# EAGLE design HDMI-DB26 (EAGLE 8.0.1)
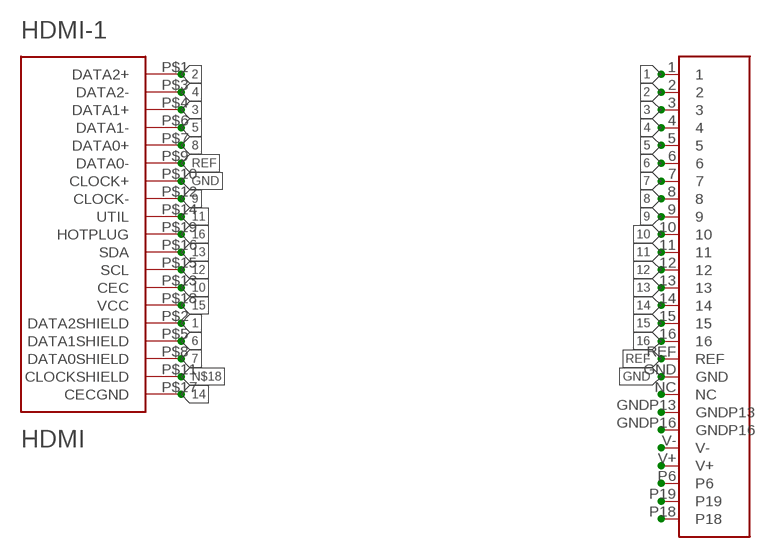
[diagram p0: schematic, sheet 1]

## Parts
DB26_1  DB26  [DB26-PLUG]
HDMI-1  HDMI  [HDMI_A]

## Nets
1: DB26_1.1 HDMI-1.P$2(DATA2SHIELD)
2: DB26_1.2 HDMI-1.P$1(DATA2+)
3: DB26_1.3 HDMI-1.P$4(DATA1+)
4: DB26_1.4 HDMI-1.P$3(DATA2-)
5: DB26_1.5 HDMI-1.P$6(DATA1-)
6: DB26_1.6 HDMI-1.P$5(DATA1SHIELD)
7: DB26_1.7 HDMI-1.P$8(DATA0SHIELD)
8: DB26_1.8 HDMI-1.P$7(DATA0+)
9: DB26_1.9 HDMI-1.P$12(CLOCK-)
10: DB26_1.10 HDMI-1.P$13(CEC)
11: DB26_1.11 HDMI-1.P$14(UTIL)
12: DB26_1.12 HDMI-1.P$15(SCL)
13: DB26_1.13 HDMI-1.P$16(SDA)
14: DB26_1.14 HDMI-1.P$17(CECGND)
15: DB26_1.15 HDMI-1.P$18(VCC)
16: DB26_1.16 HDMI-1.P$19(HOTPLUG)
GND: DB26_1.GND HDMI-1.P$10(CLOCK+)
N$18: HDMI-1.P$11(CLOCKSHIELD)
N$38: DB26_1.NC
N$39: DB26_1.GNDP13
N$40: DB26_1.GNDP16
N$41: DB26_1.V-
N$42: DB26_1.V+
N$43: DB26_1.P6
N$44: DB26_1.P19
N$45: DB26_1.P18
REF: DB26_1.REF HDMI-1.P$9(DATA0-)

## Library data of the parts
DB26_1 = HDMI-DB26:DB26
HDMI-1 = HDMI-DB26:HDMI: Horizonal HDMI type "A" jack

## Board
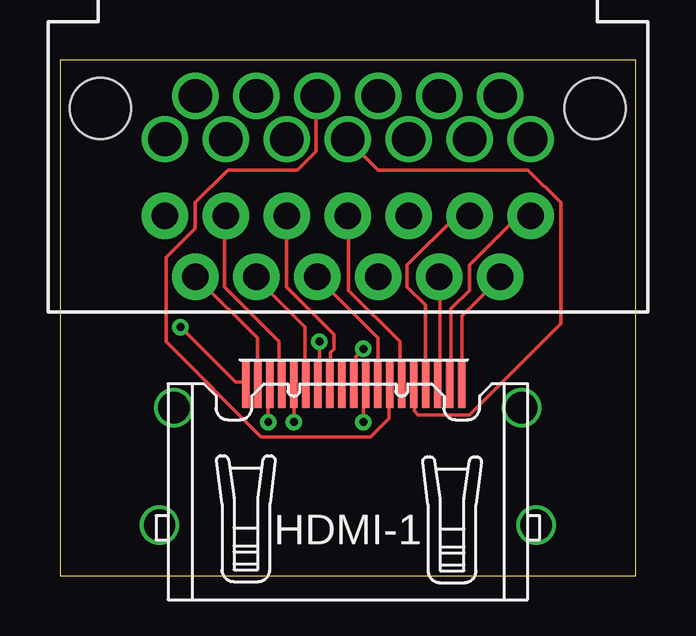
[diagram p1: board, top side]
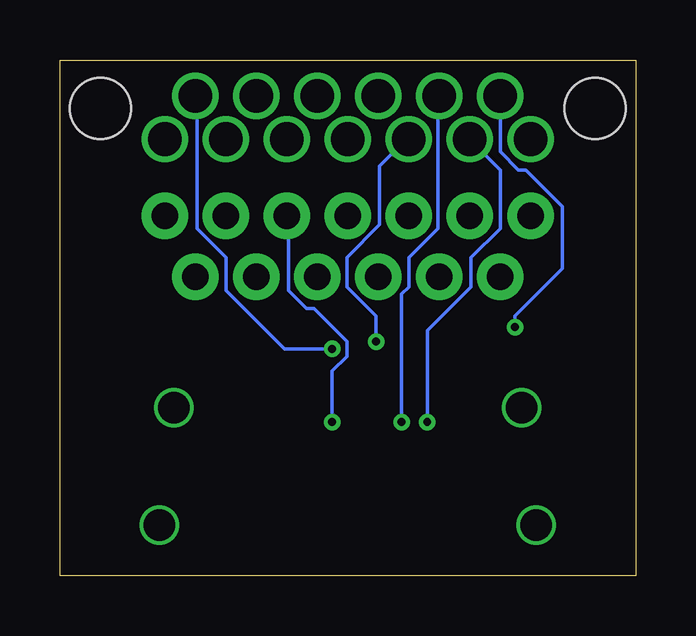
[diagram p2: board, bottom side, seen from below]

Size 24 x 21.5 mm. Coordinates in mm from the lower left corner, seen from the top.
Outline: 0,0 24,0 24,21.5 0,21.5 0,0
Copper layers (1*16): Top 0.0356mm / dielectric 1.5011mm / Bottom 0.0356mm
Design rules "OSHPark *": minimum track width 6mil, minimum drill 13mil, track to track 6mil, track to pad 6mil, pad to pad 6mil, via to via 6mil, smd to smd 6mil, copper to edge 15mil, drill to drill 6mil, minimum pad ring 7mil, minimum via ring 7mil, stop-mask expansion 3mil, vias tented up to drill 0mil, thermal gap 10mil

### Footprints (pad centres in the part's own frame; a part is rotated, then mirrored left to right if it is on the bottom)
DB26-PLUG = drill 1.106 pad 1.93: 1 7.62,4; 2 6.35,1.46; 3 5.08,4; 4 3.81,1.46; 5 0,4; 7 -1.27,1.46; 9 -2.54,4; 11 -3.81,1.46; 13 -5.08,4; 15 -6.35,1.46; GNDP13 -7.62,4; P6 1.27,1.46; REF 2.54,4 | drill 1.4 pad 1.93: 6 0,7.2; 8 -1.27,9; 10 -2.54,7.2; 12 -3.81,9; 14 -5.08,7.2; 16 -6.35,9; GND 6.35,9; GNDP16 5.08,7.2; NC -7.62,7.2; P18 2.54,7.2; P19 1.27,9; V+ 7.62,7.2; V- 3.81,9 | hole 2.54: 10.316,8.474; -10.316,8.474
HDMI_A = smd 0.3 x 1.9: P$1 4.75,3.95; P$2 4.25,3.95; P$3 3.75,3.95; P$4 3.25,3.95; P$5 2.75,3.95; P$6 2.25,3.95; P$7 1.75,3.95; P$8 1.25,3.95; P$9 0.75,3.95; P$10 0.25,3.95; P$11 -0.25,3.95; P$12 -0.75,3.95; P$13 -1.25,3.95; P$14 -1.75,3.95; P$15 -2.25,3.95; P$16 -2.75,3.95; P$17 -3.25,3.95; P$18 -3.75,3.95; P$19 -4.25,3.95 | drill 1.3: P$20 -7.25,3; P$21 7.25,3; P$22 7.85,-1.9; P$23 -7.85,-1.9

### Placement (x,y rotation side)
DB26_1  12,11 0 top
HDMI-1  12,4 0 top

### Tracks (layer width: path | path; a pad name or v marks a point on that pad's centre or on a via)
1
  Top 0.152: HDMI-1.P$2 16.31,8.08 16.31,11.12 17.07,11.89 17.07,12.95 19.05,14.94 19.51,14.94 DB26_1.1
2
  Top 0.152: HDMI-1.P$1 16.76,8.08 16.76,10.82 18.29,12.34 DB26_1.2
3
  Top 0.152: HDMI-1.P$4 15.24,8.08 15.24,11.28 14.48,12.04 14.48,12.95 16.46,14.94 17.07,14.94 DB26_1.3
4
  Top 0.152: HDMI-1.P$3 15.85,8.08 15.85,12.34 DB26_1.4
5
  Top 0.152: HDMI-1.P$6 14.17,8.08 14.17,9.75 12.04,11.89 12.04,14.94 DB26_1.5
6
  Top 0.152: HDMI-1.P$5 14.78,7.92 14.78,6.86 14.94,6.71 17.07,6.71 20.88,10.52 20.88,15.54 19.51,16.92 13.26,16.92 12.04,18.14 DB26_1.6
7
  Top 0.152: HDMI-1.P$8 13.26,8.08 13.26,9.91 10.82,12.34 DB26_1.7
8
  Top 0.152: HDMI-1.P$7 13.72,7.92 13.72,6.55 12.95,5.79 8.38,5.79 4.42,9.75 4.42,13.26 5.64,14.48 5.64,15.54 7.01,16.92 9.91,16.92 10.67,17.68 10.67,19.96 DB26_1.8
9
  Top 0.152: HDMI-1.P$12 11.28,8.08 11.28,9.3 11.43,9.45 11.43,10.06 9.45,12.04 9.45,14.94 DB26_1.9
10  (via drill 0.33)
  Top 0.152: v10.82,9.75 10.82,8.08 HDMI-1.P$13
  Bottom 0.152: v10.82,9.75 10.82,10.82 12.04,12.04 12.04,13.26 10.67,14.63 10.67,17.07 9.6,18.14 DB26_1.10
11
  Top 0.152: HDMI-1.P$14 10.21,8.08 10.21,10.36 8.23,12.34 DB26_1.11
12  (via drill 0.33)
  Top 0.152: v9.75,6.4 9.75,7.92 HDMI-1.P$15
  Bottom 0.152: v9.75,6.4 9.75,11.73 9.45,12.04 9.45,13.26 8.23,14.48 8.23,19.96 DB26_1.12
13
  Top 0.152: HDMI-1.P$16 9.14,8.08 9.14,9.75 6.86,12.04 6.86,14.94 DB26_1.13
14  (via drill 0.33)
  Top 0.152: v8.69,6.4 8.69,7.92 HDMI-1.P$17
  Bottom 0.152: v8.69,6.4 8.69,10.21 6.86,12.04 6.86,13.26 5.64,14.48 5.64,16.92 6.86,18.14 DB26_1.14
15
  Top 0.152: HDMI-1.P$18 8.23,8.08 8.23,9.91 5.79,12.34 DB26_1.15
16  (via drill 0.33)
  Top 0.152: v5.03,10.36 7.32,8.08 7.62,8.08 HDMI-1.P$19
  Bottom 0.152: v5.03,10.36 5.03,10.82 3.05,12.8 3.05,15.39 4.57,16.92 4.88,16.92 5.64,17.68 5.64,19.96 DB26_1.16
GND  (via drill 0.33)
  Top 0.152: v12.65,9.45 12.34,9.14 12.34,8.08 HDMI-1.P$10
  Bottom 0.152: v12.65,9.45 14.63,9.45 17.07,11.89 17.07,13.26 18.29,14.48 18.29,19.96 DB26_1.GND
REF  (via drill 0.33)
  Top 0.152: v12.65,6.4 12.65,7.92 HDMI-1.P$9
  Bottom 0.152: v12.65,6.4 12.65,8.53 12.04,9.14 12.04,9.75 13.41,11.12 13.72,11.12 14.48,11.89 14.48,14.94 DB26_1.REF